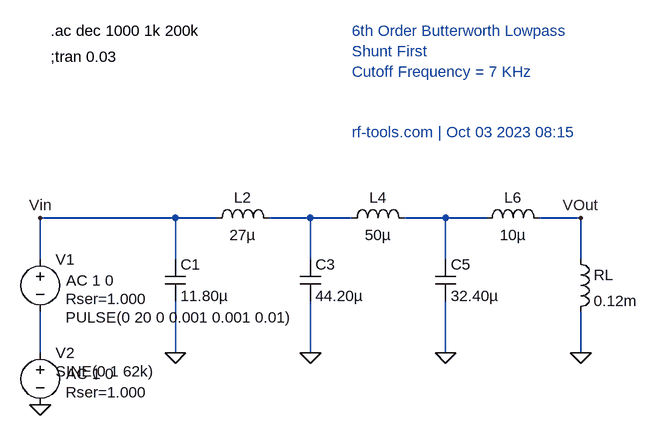
[diagram p0: schematic filter (10).asc]
filter (10).asc, the LTspice schematic file:
Version 4
SHEET 1 1200 400
WIRE 208 0 0 0
WIRE 272 0 208 0
WIRE 416 0 352 0
WIRE 480 0 416 0
WIRE 624 0 560 0
WIRE 688 0 624 0
WIRE 832 0 768 0
WIRE 0 64 0 0
WIRE 208 64 208 0
WIRE 416 64 416 0
WIRE 624 64 624 0
WIRE 832 64 832 0
WIRE 0 208 0 144
WIRE 208 208 208 128
WIRE 416 208 416 128
WIRE 624 208 624 128
WIRE 832 208 832 144
FLAG 208 208 0
FLAG 416 208 0
FLAG 624 208 0
FLAG 832 208 0
FLAG 0 288 0
FLAG 0 0 Vin
FLAG 832 0 VOut
SYMBOL voltage 0 48 R0
WINDOW 123 40 48 Left 2
WINDOW 39 39 77 Left 2
WINDOW 3 39 105 Left 2
SYMATTR Value2 AC 1 0
SYMATTR SpiceLine Rser=1.000
SYMATTR Value PULSE(0 20 0 0.001 0.001 0.01)
SYMATTR InstName V1
SYMBOL cap 192 64 R0
SYMATTR InstName C1
SYMATTR Value 11.80µ
SYMBOL ind 256 16 R270
WINDOW 0 32 56 VTop 2
WINDOW 3 5 56 VBottom 2
SYMATTR InstName L2
SYMATTR Value 27µ
SYMBOL cap 400 64 R0
SYMATTR InstName C3
SYMATTR Value 44.20µ
SYMBOL ind 464 16 R270
WINDOW 0 32 56 VTop 2
WINDOW 3 5 56 VBottom 2
SYMATTR InstName L4
SYMATTR Value 50µ
SYMBOL cap 608 64 R0
SYMATTR InstName C5
SYMATTR Value 32.40µ
SYMBOL ind 672 16 R270
WINDOW 0 32 56 VTop 2
WINDOW 3 5 56 VBottom 2
SYMATTR InstName L6
SYMATTR Value 10µ
SYMBOL ind 816 48 R0
SYMATTR InstName RL
SYMATTR Value 0.12m
SYMATTR SpiceLine Rser=0.2
SYMBOL voltage 0 192 R0
WINDOW 123 40 48 Left 2
WINDOW 39 39 77 Left 2
WINDOW 3 24 44 Left 2
SYMATTR Value2 AC 1 0
SYMATTR SpiceLine Rser=1.000
SYMATTR Value SINE(0 1 62k)
SYMATTR InstName V2
TEXT 16 -288 Left 2 !.ac dec 1000 1k 200k
TEXT 480 -288 Left 2 ;6th Order Butterworth Lowpass\nShunt First\nCutoff Frequency = 7 KHz\n\n\nrf-tools.com | Oct 03 2023 08:15
TEXT 16 -248 Left 2 !;tran 0.03

The netlist it stands for:
* filter (10).asc
V1 Vin N003 PULSE(0 20 0 0.001 0.001 0.01) AC 1 0 Rser=1.000
C1 Vin 0 11.80µ
L2 Vin N001 27µ
C3 N001 0 44.20µ
L4 N001 N002 50µ
C5 N002 0 32.40µ
L6 N002 VOut 10µ
L§RL VOut 0 0.12m Rser=0.2
V2 N003 0 SINE(0 1 62k) AC 1 0 Rser=1.000
.ac dec 1000 1k 200k
* 6th Order Butterworth Lowpass
* Shunt First
* Cutoff Frequency = 7 KHz
* rf-tools.com | Oct 03 2023 08:15
;tran 0.03
.backanno
.end